# EAGLE design SparkFun_Buck_Regulator_AP63357DV-7_BabyBuck5V (EAGLE 9.6.2)
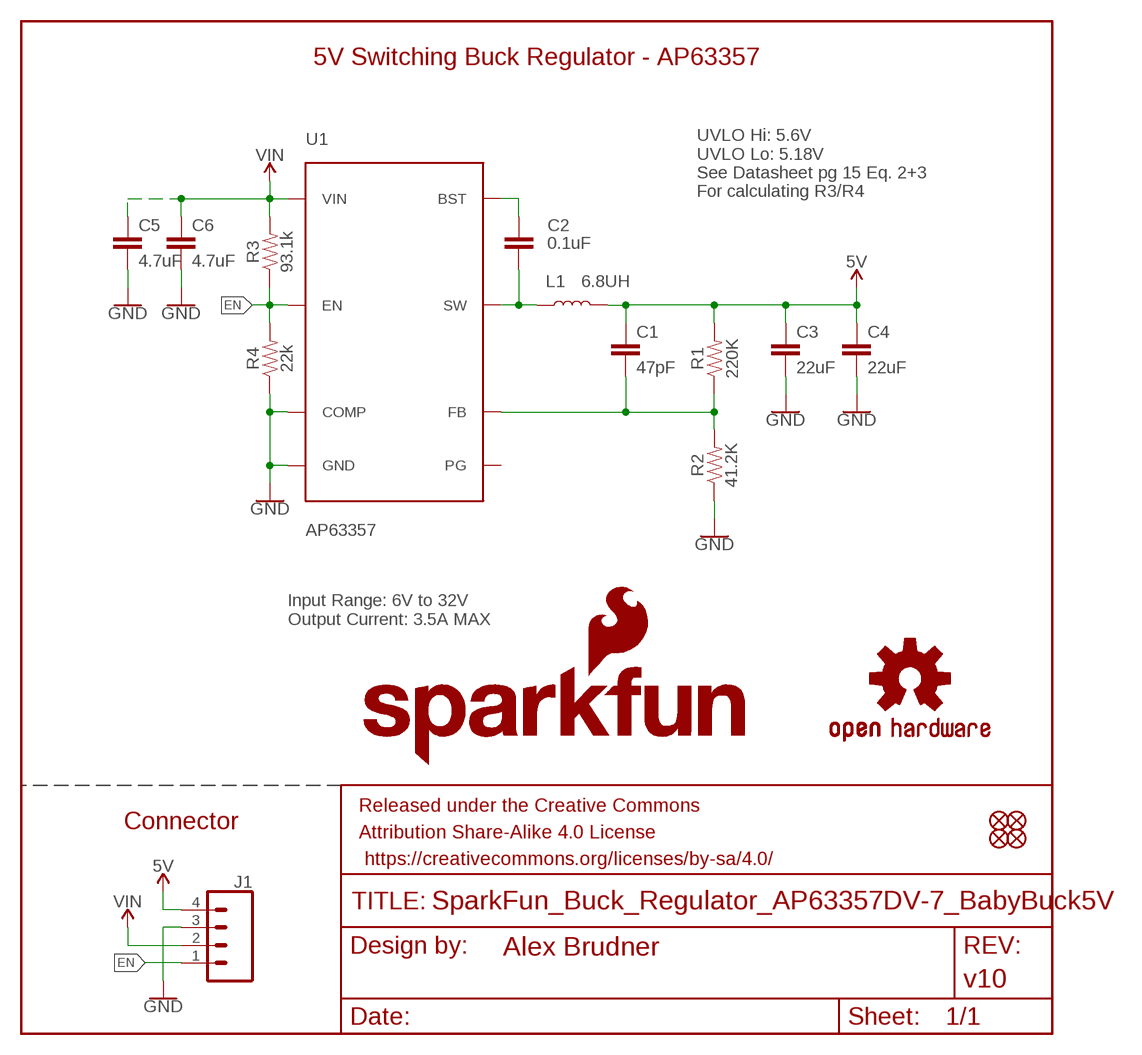
[diagram p0: schematic, sheet 1]

## Parts
C1  47pF  47PF-0402_TIGHT-25V-5%-X7R  [0402-TIGHT]
C2  0.1uF  0.1UF-0402T-16V-10%  [0402-TIGHT]
C3  22uF  22UF-0805-16V-20%  [0805]
C4  22uF  22UF-0805-16V-20%  [0805]
C5  4.7uF  4.7UF-0805-50V-(10%)  [0805]
C6  4.7uF  4.7UF-0805-50V-(10%)  [0805]
FD1  FIDUCIALUFIDUCIAL  [FIDUCIAL-MICRO]
FD2  FIDUCIALUFIDUCIAL  [FIDUCIAL-MICRO]
FD3  FIDUCIALUFIDUCIAL  [FIDUCIAL-MICRO]
FD4  FIDUCIALUFIDUCIAL  [FIDUCIAL-MICRO]
FRAME1  FRAME-LEDGER  [CREATIVE_COMMONS]
J1  CONN_041X04_NO_SILK_NO_POP  [1X04_NO_SILK]
L1  6.8UH  [07A7_6U8H]
LOGO1  SFE_LOGO_NAME_FLAMEBLANK  [BLANK]
LOGO2  OSHW-LOGOMINI  [OSHW-LOGO-MINI]
R1  220K  220KOHM-0402T-1/16W-1%  [0402-TIGHT]
R2  41.2K  41.2KOHM-0402-1/16W-1%(41.2KOHM)  [0402-TIGHT]
R3  93.1k  93.1KOHM-0402-1/16W-1%(93.1KOHM)  [0402-TIGHT]
R4  22k  22KOHM-0402_TIGHT-1/10W-1%  [0402-TIGHT]
U1  AP63357  [V-DFN3020-13]

## Nets
5V: C1.1 C3.1 C4.1 J1.4 L1.P$2 R1.2
EN: J1.1 R3.1 R4.2 U1.P$2(EN)
FB: C1.2 R1.1 R2.2 U1.P$3(FB)
GND: C3.2 C4.2 C5.2 C6.2 J1.3 R2.1 R4.1 U1.P$4(COMP) U1.P$8(GND)
N$4: C2.1 U1.P$6(BST)
SW: C2.2 L1.P$1 U1.P$7(SW) U1.P$9(SW)
VIN: C5.1 C6.1 J1.2 R3.2 U1.P$1(VIN)
Unconnected: U1.P$5(PG)

## Notes on the sheet
- 5V Switching Buck Regulator - AP63357
- UVLO Hi: 5.6V
  UVLO Lo: 5.18V
  See Datasheet pg 15 Eq. 2+3 
  For calculating R3/R4
- Input Range: 6V to 32V
  Output Current: 3.5A MAX
- Connector

## Library data of the parts
C1 = SparkFun-Capacitors:47PF: 47pF ceramic capacitors A capacitor is a passive two-terminal electrical component used to store electrical energy temporarily in an electric field.; PROD_ID: CAP-15063
C2 = SparkFun-Capacitors:0.1UF: 0.1µF ceramic capacitors A capacitor is a passive two-terminal electrical component used to store electrical energy temporarily in an electric field.; PROD_ID: CAP-12416
C3 C4 = SparkFun-Capacitors:22UF: 22µF ceramic capacitors A capacitor is a passive two-terminal electrical component used to store electrical energy temporarily in an electric field.; PROD_ID: CAP-14260
C5 C6 = SparkFun-Capacitors:4.7UF: 4.7µF ceramic capacitors A capacitor is a passive two-terminal electrical component used to store electrical energy temporarily in an electric field.; PROD_ID: CAP-15457
FD1-FD4 = SparkFun-Aesthetics:FIDUCIAL: Fiducial Alignment Points Point-of-reference for pick-and-place machines and other optical instruments.
FRAME1 = SparkFun-Aesthetics:FRAME-LEDGER: Schematic Frame - Ledger Standard 11x14 US Ledger frame; DESIGNER: Alex Brudner; REV: v10
J1 = SparkFun-Connectors:CONN_04: Multi connection point. Often used as Generic Header-pin footprint for 0.1 inch spaced/style header connections On any of the 0.1 inch spaced packages, you can populate with these: Break Away Headers - Straight <https://www.sparkfun.com/products/116> (PRT-00116) Break Away Male Headers - Right Angle <https://www.sparkfun.com/products/553> (PRT-00553) Female Headers <https://www.sparkfun.com/products/115> (PRT-00115) Break Away Headers - Machine Pin <https://www.sparkfun.com/products/117> (PRT-00117) Break Away Female Headers - Swiss Machine Pin <https://www.sparkfun.com/products/743> (PRT-00743) For SCREWTERMINALS and SPRING TERMINALS visit here: Screw Terimnals on SparkFun.com <https://www.sparkfun.com/search/results?term=Screw+Terminals> (5mm/3.5mm/2.54mm spacing) This device is also useful as a general connection point to wire up your design to another part of your project. Our various solder wires solder well into these plated through hole pads. Hook-Up Wire - Assortment (Stranded, 22 AWG) <https://www.sparkfun.com/products/11375> (PRT-11375) Hook-Up Wire - Assortment (Solid Core, 22 AWG) <https://www.sparkfun.com/products/11367> (PRT-11367) View the entire wire category on our website here <https://www.sparkfun.com/categories/141> Special notes: Molex polarized connector foot print use with SKU : PRT-08231 with associated crimp pins and housings. 1MM SMD Version SKU: PRT-10208
L1 = Buck5V:6.8UH; PN: LMLP07A7M6R8DTAS; PROD_ID: NDUC-17223
LOGO1 = SparkFun-Aesthetics:SFE_LOGO_NAME_FLAME: SparkFun Font Logo w/ Flame This is the SparkFun full logo. The logo on the schematic will always be the same size; the package variant is the height of the flame part of the logo. Default layer for the logo on the board is tSilk.
LOGO2 = SparkFun-Aesthetics:OSHW-LOGO: Open-Source Hardware (OSHW) Logo This logo indicates the piece of hardware it is found on incorporates a OSHW license and/or adheres to the definition of open source hardware found here: http://freedomdefined.org/OSHW
R1 = SparkFun-Resistors:220KOHM: 220kΩ resistor A resistor is a passive two-terminal electrical component that implements electrical resistance as a circuit element. Resistors act to reduce current flow, and, at the same time, act to lower voltage levels within circuits. - Wikipedia; PROD_ID: RES-15094; RES: 220K
R2 = Buck5V:41.2KOHM; PN: RC0402FR-0741K2L; PROD_ID: RES-15010
R3 = Buck5V:93.1KOHM; PN: RC0402FR-0793K1L; PROD_ID: RES-17226
R4 = SparkFun-Resistors:22KOHM: 22kΩ resistor A resistor is a passive two-terminal electrical component that implements electrical resistance as a circuit element. Resistors act to reduce current flow, and, at the same time, act to lower voltage levels within circuits. - Wikipedia; PROD_ID: RES-14281
U1 = Buck5V:AP63357: The AP63356/AP63357 is a 3.5A, synchronous buck converter with a wide input voltage range of 3.8V to 32V. The device fully integrates a 74mΩ high-side power MOSFET and a 40mΩ low-side power MOSFET to provide high-efficiency step-down DC-DC conversion.; PN: AP63357DV-7; PROD_ID: VREG-17224

## Board
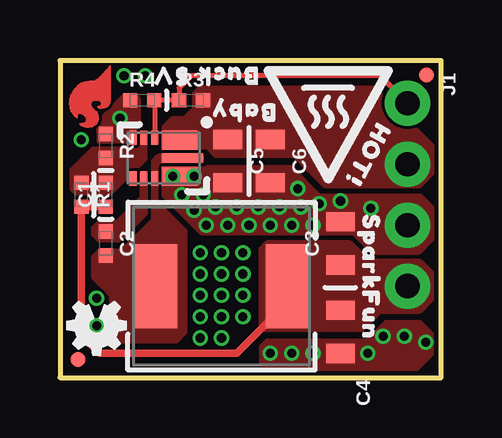
[diagram p1: board, top side]
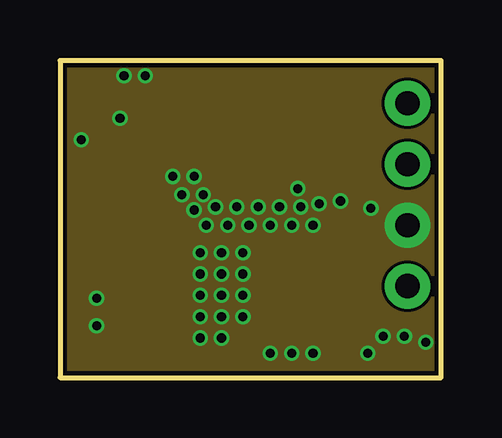
[diagram p2: board, inner layer Route2]
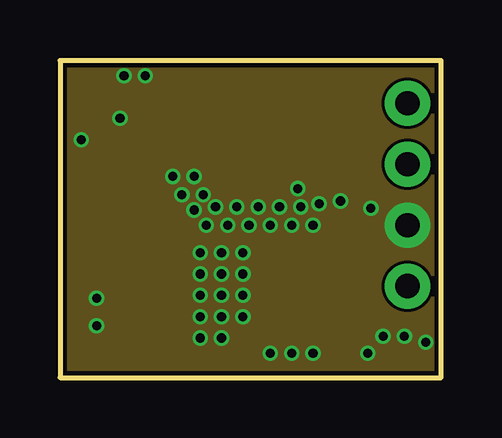
[diagram p3: board, inner layer Route15]
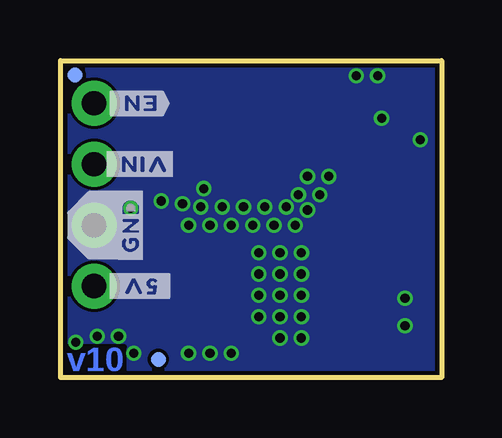
[diagram p4: board, bottom side, seen from below]

Size 15.88 x 13.21 mm. Coordinates in mm from the lower left corner, seen from the top.
Outline: 0,0 15.88,0 15.88,13.21 0,13.21 0,0
Copper layers (1*2*15*16): Top 0.035mm / dielectric 0.2104mm / Route2 0.035mm / dielectric 0.24mm / Route15 0.035mm / dielectric 0.2104mm / Bottom 0.035mm
Design rules "SparkFun-4-Layer-Minimum-JLCPCB *": minimum track width 5mil, minimum drill 0.2mm, track to track 5mil, track to pad 5mil, pad to pad 5mil, via to via 5mil, smd to smd 5mil, copper to edge 7mil, drill to drill 7mil, minimum pad ring 5mil, minimum via ring 5mil, stop-mask expansion 2.5mil, vias tented up to drill 25mil, thermal gap 10mil

### Footprints (pad centres in the part's own frame; a part is rotated, then mirrored left to right if it is on the bottom)
0402-TIGHT = smd 0.6 x 0.6: 1 -0.5,0; 2 0.5,0
0805 = smd 0.8 x 1.2: 1 -0.9,0; 2 0.9,0
FIDUCIAL-MICRO = smd 0.635 x 0.635: 1 0,0
1X04_NO_SILK = drill 1.016 pad 1.88: 1 0,0; 2 2.54,0; 3 5.08,0; 4 7.62,0
07A7_6U8H = smd 1.85 x 3.5: P$1 -2.775,0; P$2 2.775,0
V-DFN3020-13 = smd 1.5 x 0.8: P$1 -0.675,-0.75; P$8 -0.675,0.75 | smd 0.3 x 0.6: P$2 0.375,-0.85; P$3 0.825,-0.85; P$4 1.275,-0.85; P$5 1.275,0.85; P$6 0.825,0.85; P$7 0.375,0.85 | smd 1.73 x 0.4: P$9 -0.79,0

### Placement (x,y rotation side)
C1  1.91,7.62 90 top
C2  1.91,5.59 270 top
C3  11.68,5.59 90 top
C4  11.68,1.91 270 top
C5  6.99,9.02 270 top
C6  8.76,9.02 270 top
FD1  15.27,12.6 0 bottom
FD2  0.75,0.75 0 top
FD3  15.27,12.6 0 top
FD4  11.8,0.75 0 bottom
FRAME1  20.7,-16.51 0 top  (outside the outline)
J1  14.48,11.43 270 top
L1  6.73,3.81 0 top
LOGO1  14.86,0.25 0 top
LOGO2  1.52,2.16 180 top
R1  0.89,7.62 270 top
R2  1.91,9.65 270 top
R3  5.46,11.56 0 top
R4  3.43,11.56 0 top
U1  4.32,9.14 180 top
U$1  [SFE_LOGO_FLAME_COPPER_EXPOSED_.1]  1.27,11.68 180 top
U$2  [#EN_#10]  12.7,11.43 180 bottom
U$3  [#VIN_#11]  12.57,8.89 180 bottom
U$4  [#GND#13]  12.95,6.35 90 bottom
U$5  [#_5V_#6]  12.57,3.81 180 bottom
U$6  [BABY0]  7.62,11.05 180 top
U$7  [BUCK0]  6.99,12.57 180 top
U$8  [HIGH_TEMP_WARNING]  11.18,11.18 180 top
U$9  [5V0]  4.57,12.57 180 top
U$10  [HOT##7]  12.83,9.27 241 top
U$14  [SPARKFUN0]  12.95,4.19 270 top
U$17  [ORDERING_INSTRUCTIONS]  25.4,42.55 0 top  (outside the outline)

### Tracks (layer width: path | path; a pad name or v marks a point on that pad's centre or on a via)
5V
  Top 0.305: L1.P$2 9.51,3.16 7.37,1.02 1.65,1.02 0.89,1.78 R1.2 C1.1
  pour Top (isolate 0.203, no thermals): 14.99,4.83 12.83,4.83 12.06,5.59 8.64,5.59 8.38,5.33 8.38,2.03 12.57,2.03 13.34,2.79 14.99,2.79 15.49,3.3 15.49,4.32
EN
  Top 0.203: U1.P$2 3.94,11.54 R4.2 R3.1 4.96,12.07 5.46,12.57 13.34,12.57 J1.1
FB
  pour Top (rank 2, no thermals): 3.54,10.19 3.54,9.13 2.08,7.67 0.7,7.67 0.51,7.86 0.51,8.64 1.4,9.53 3.33,9.53 3.45,9.65 3.45,10.19
GND  (via drill 0.38)
  other vias: 3.56,12.57 2.67,12.57 2.5,10.8 0.89,9.91 4.7,8.38 5.59,8.38 5.08,7.62 5.97,7.62 5.59,6.99 6.1,6.35 6.48,7.11 7.37,7.11 8.26,7.11 6.99,6.35 7.87,6.35 8.76,6.35 9.14,7.11 9.65,6.35 10.54,6.35 10.03,7.11 9.91,7.87 10.79,7.24 11.69,7.36 12.95,7.06 1.52,3.3 1.52,2.16 5.84,1.65 6.73,1.65 5.84,2.54 5.84,3.43 5.84,4.32 5.84,5.21 6.73,5.21 7.62,5.21 6.73,4.32 7.62,4.32 6.73,3.43 6.73,2.54 7.62,2.54 7.62,3.43 8.76,1.02 9.65,1.02 10.54,1.02 12.83,1.02 14.35,1.73 15.24,1.47 13.46,1.73
  pour Top (rank 3, no thermals): 4.35,8.69 6.07,8.69 6.14,8.76 9.58,8.76 10.76,7.58 14.98,7.58 15.49,7.07 15.49,5.78 14.92,5.21 13.08,5.21 12.27,6.02 5.93,6.02 4.35,7.6
  pour Top (rank 3, no thermals): 1.61,9.88 1.71,9.78 3.09,9.78 3.09,10.37 3.27,10.55 3.27,11.59 3.11,11.75 2.71,11.75 1.61,10.65
  pour Top (rank 2, no thermals): 8.64,0.38 14.86,0.38 15.49,1.02 15.49,1.78 14.99,2.29 13.59,2.29 12.83,1.52 8.64,1.52 8.38,1.27 8.38,0.64
  pour Route2 (rank 2, no thermals): -0.13,13.46 15.88,13.46 15.88,-0.13 -0.13,-0.13
  pour Route15 (rank 2, no thermals): -0.13,13.46 15.88,13.46 15.88,-0.13 -0.13,-0.13
  pour Bottom (rank 2, no thermals): -0.13,13.46 15.88,13.46 15.88,-0.13 -0.13,-0.13
N$4
  pour Top (rank 2, no thermals): 3.56,8.51 3.56,6.86 2.41,5.71 1.65,5.71 1.4,5.97 1.4,6.22 1.65,6.48 2.41,6.48 3.43,7.49 3.43,8.51
SW
  pour Top (no thermals): 5.88,9.24 5.88,9.05 4.25,9.05 3.99,8.79 3.99,7.32 5.21,6.1 5.21,1.91 4.83,1.52 2.54,1.52 2.16,1.91 2.16,3.43 1.4,4.19 1.4,5.01 1.67,5.29 2.62,5.29 3.9,6.56 3.9,9.02 4.11,9.24
VIN
  pour Top (isolate 0.127, rank 2, no thermals): 4.32,9.61 6.14,9.61 6.48,9.27 9.78,9.27 11.05,8 14.99,8 15.62,8.64 15.62,9.53 13.08,12.06 5.84,12.06 5.59,11.81 5.59,11.18 5.21,10.79 4.7,10.79 4.32,10.41

### Text on the board
Bottom: v10
Measures: UNITS IN INCHES
tDocu: Board thickness is 0.8mm / 4-Layer / 1oz copper outer / 1oz copper inner | Alex Brudner